# Altium schematic sheet PA_CTRL_TOP.SchDoc: 8 channel PA
size 420 x 297 mm; Author: G.K.; CompanyName: WUT; DrawnBy: G.K.; Organization: WUT ISE; Address1: Warsaw Univeristy of Technology; Address2: Nowowiejska 15/19; Revision: -; SheetNumber: -; SheetTotal: -; EDA_Number: ARTIQ; Projet: 8 Channel RF Power Amplifier; ModifiedBy: -; CreateDate: XX/XX/XXXX; CheckedDate: -; Title2: TOP; DivGrp: ISE; Designer: G.K.; ModifiedDate: -; ProjectName: 8 Channel RF Power Amplifier
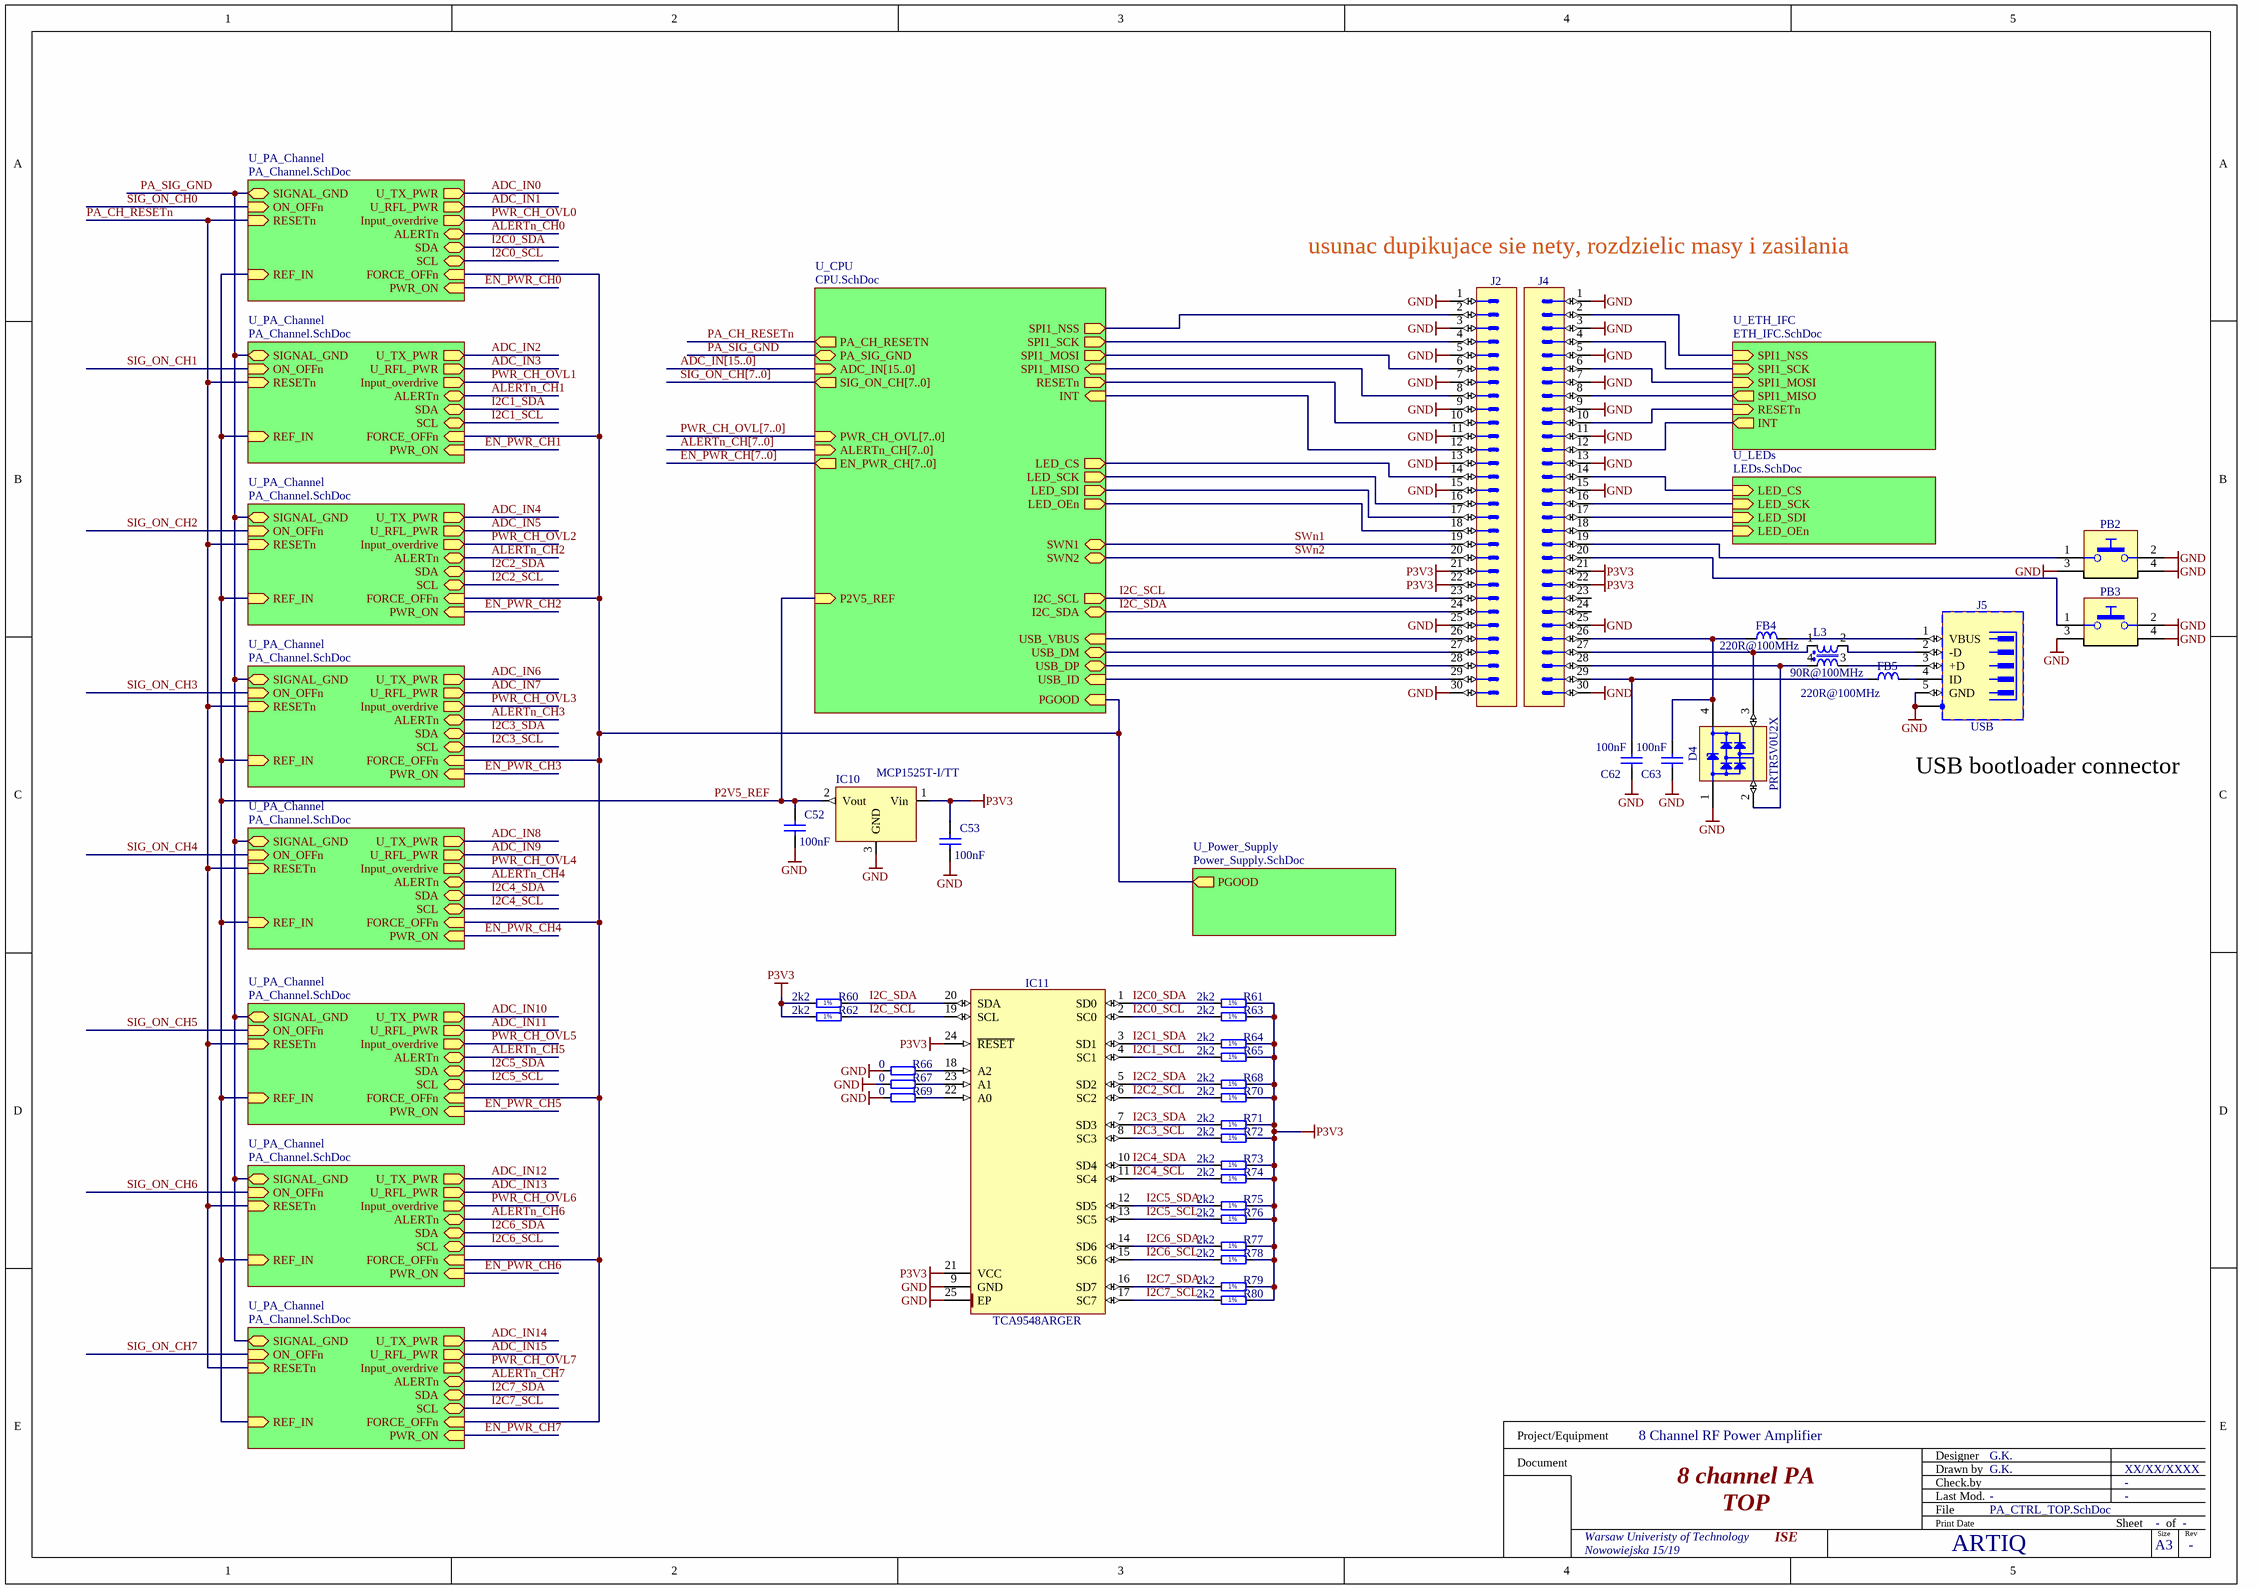
[diagram p0: PA_CTRL_TOP.SchDoc]

## Parts
C52  100nF  [CAPC1005X55N]
C53  100nF  [CAPC1005X55N]
C62  100nF  [CAPC0603X33N]
C63  100nF  [CAPC0603X33N]
D4  PRTR5V0U2X  [SOT190P230X110-4N]
FB4  220R@100MHz  [INDC2012X105N]
FB5  220R@100MHz  [INDC2012X105N]
IC10  MCP1525T-I/TT  [SOT95P251X112-3N]
IC11  TCA9548ARGER  [QFN50P400X400X100-25N-S220]
J2  (no value)  [3M_N2530-6002RB]
J4  (no value)  [3M_N2530-6002RB]
J5  USB  [WURTH_651005136521]
L3  90R@100MHz  [IND_MURATA_DLW21S]
PB2  Push Button  [PB_TYCO_1-1825027-1]  (value not drawn)
PB3  Push Button  [PB_TYCO_1-1825027-1]  (value not drawn)
R60  2k2  [RESC1005X40N]
R61  2k2  [RESC1005X40N]
R62  2k2  [RESC1005X40N]
R63  2k2  [RESC1005X40N]
R64  2k2  [RESC1005X40N]
R65  2k2  [RESC1005X40N]
R66  0  [RESC1005X40N]
R67  0  [RESC1005X40N]
R68  2k2  [RESC1005X40N]
R69  0  [RESC1005X40N]
R70  2k2  [RESC1005X40N]
R71  2k2  [RESC1005X40N]
R72  2k2  [RESC1005X40N]
R73  2k2  [RESC1005X40N]
R74  2k2  [RESC1005X40N]
R75  2k2  [RESC1005X40N]
R76  2k2  [RESC1005X40N]
R77  2k2  [RESC1005X40N]
R78  2k2  [RESC1005X40N]
R79  2k2  [RESC1005X40N]
R80  2k2  [RESC1005X40N]

## Sub-sheets
U_CPU = CPU.SchDoc: ADC_IN[15..0] (in), SIG_ON_CH[7..0] (out), PWR_CH_OVL[7..0] (in), ALERTn_CH[7..0] (in), SPI1_NSS (out), SPI1_SCK (out), SPI1_MOSI (out), SPI1_MISO (in), RESETn (out), INT (in), LED_CS (out), LED_SCK (out), LED_SDI (out), LED_OEn (out), I2C_SCL (out), I2C_SDA (bidir), P2V5_REF (in), USB_DP (bidir), USB_ID (in), USB_DM (bidir), USB_VBUS (in), PA_SIG_GND (bidir), PA_CH_RESETN (out), PGOOD (in), EN_PWR_CH[7..0] (out), SWN1 (bidir), SWN2 (bidir)
U_ETH_IFC = ETH_IFC.SchDoc: SPI1_NSS (in), SPI1_SCK (in), SPI1_MOSI (in), SPI1_MISO (out), INT (out), RESETn (in)
U_LEDs = LEDs.SchDoc: LED_CS (in), LED_SCK (in), LED_SDI (in), LED_OEn (in)
U_PA_Channel = PA_Channel.SchDoc: U_TX_PWR (out), U_RFL_PWR (out), SIGNAL_GND (bidir), SDA (bidir), SCL (bidir), ON_OFFn (in), Input_overdrive (out), ALERTn (bidir), RESETn (in), REF_IN (in), PWR_ON (in), FORCE_OFFn (in)
U_PA_Channel = PA_Channel.SchDoc: U_TX_PWR (out), U_RFL_PWR (out), SIGNAL_GND (bidir), SDA (bidir), SCL (bidir), ON_OFFn (in), Input_overdrive (out), ALERTn (bidir), RESETn (in), REF_IN (in), PWR_ON (in), FORCE_OFFn (in)
U_PA_Channel = PA_Channel.SchDoc: U_TX_PWR (out), U_RFL_PWR (out), SIGNAL_GND (bidir), SDA (bidir), SCL (bidir), ON_OFFn (in), Input_overdrive (out), ALERTn (bidir), RESETn (in), REF_IN (in), PWR_ON (in), FORCE_OFFn (in)
U_PA_Channel = PA_Channel.SchDoc: U_TX_PWR (out), U_RFL_PWR (out), SIGNAL_GND (bidir), SDA (bidir), SCL (bidir), ON_OFFn (in), Input_overdrive (out), ALERTn (bidir), RESETn (in), REF_IN (in), PWR_ON (in), FORCE_OFFn (in)
U_PA_Channel = PA_Channel.SchDoc: U_TX_PWR (out), U_RFL_PWR (out), SIGNAL_GND (bidir), SDA (bidir), SCL (bidir), ON_OFFn (in), Input_overdrive (out), ALERTn (bidir), RESETn (in), REF_IN (in), PWR_ON (in), FORCE_OFFn (in)
U_PA_Channel = PA_Channel.SchDoc: U_TX_PWR (out), U_RFL_PWR (out), SIGNAL_GND (bidir), SDA (bidir), SCL (bidir), ON_OFFn (in), Input_overdrive (out), ALERTn (bidir), RESETn (in), REF_IN (in), PWR_ON (in), FORCE_OFFn (in)
U_PA_Channel = PA_Channel.SchDoc: U_TX_PWR (out), U_RFL_PWR (out), SIGNAL_GND (bidir), SDA (bidir), SCL (bidir), ON_OFFn (in), Input_overdrive (out), ALERTn (bidir), RESETn (in), REF_IN (in), PWR_ON (in), FORCE_OFFn (in)
U_PA_Channel = PA_Channel.SchDoc: U_TX_PWR (out), U_RFL_PWR (out), SIGNAL_GND (bidir), SDA (bidir), SCL (bidir), ON_OFFn (in), Input_overdrive (out), ALERTn (bidir), RESETn (in), REF_IN (in), PWR_ON (in), FORCE_OFFn (in)
U_Power_Supply = Power_Supply.SchDoc: PGOOD (out)

## Nets
GND: C52.2 C53.2 C62.1 C63.1 D4.1(GND) IC10.3(GND) IC11.9(GND) IC11.25(EP) J2.1 J2.3 J2.5 J2.7 J2.9 J2.11 J2.13 J2.15 J2.25 J2.30 J4.1 J4.3 J4.5 J4.7 J4.9 J4.11 J4.13 J4.15 J4.25 J4.30 J5.5(GND) J5.6(SH) PB2.2 PB2.3 PB2.4 PB3.2 PB3.3 PB3.4 R66.1 R67.1 R69.1
P3V3: C53.1 IC10.1(Vin) IC11.21(VCC) IC11.24(~{RESET}) J2.21 J2.22 J4.21 J4.22 R60.1 R61.2 R62.1 R63.2 R64.2 R65.2 R68.2 R70.2 R71.2 R72.2 R73.2 R74.2 R75.2 R76.2 R77.2 R78.2 R79.2 R80.2
ADC_IN0: sheet U_PA_Channel/U_TX_PWR
ADC_IN1: sheet U_PA_Channel/U_RFL_PWR
ADC_IN2: sheet U_PA_Channel/U_TX_PWR
ADC_IN3: sheet U_PA_Channel/U_RFL_PWR
ADC_IN4: sheet U_PA_Channel/U_TX_PWR
ADC_IN5: sheet U_PA_Channel/U_RFL_PWR
ADC_IN6: sheet U_PA_Channel/U_TX_PWR
ADC_IN7: sheet U_PA_Channel/U_RFL_PWR
ADC_IN8: sheet U_PA_Channel/U_TX_PWR
ADC_IN9: sheet U_PA_Channel/U_RFL_PWR
ADC_IN10: sheet U_PA_Channel/U_TX_PWR
ADC_IN11: sheet U_PA_Channel/U_RFL_PWR
ADC_IN12: sheet U_PA_Channel/U_TX_PWR
ADC_IN13: sheet U_PA_Channel/U_RFL_PWR
ADC_IN14: sheet U_PA_Channel/U_TX_PWR
ADC_IN15: sheet U_PA_Channel/U_RFL_PWR
ALERTn_CH0: sheet U_PA_Channel/ALERTn
ALERTn_CH1: sheet U_PA_Channel/ALERTn
ALERTn_CH2: sheet U_PA_Channel/ALERTn
ALERTn_CH3: sheet U_PA_Channel/ALERTn
ALERTn_CH4: sheet U_PA_Channel/ALERTn
ALERTn_CH5: sheet U_PA_Channel/ALERTn
ALERTn_CH6: sheet U_PA_Channel/ALERTn
ALERTn_CH7: sheet U_PA_Channel/ALERTn
EN_PWR_CH0: sheet U_PA_Channel/PWR_ON
EN_PWR_CH1: sheet U_PA_Channel/PWR_ON
EN_PWR_CH2: sheet U_PA_Channel/PWR_ON
EN_PWR_CH3: sheet U_PA_Channel/PWR_ON
EN_PWR_CH4: sheet U_PA_Channel/PWR_ON
EN_PWR_CH5: sheet U_PA_Channel/PWR_ON
EN_PWR_CH6: sheet U_PA_Channel/PWR_ON
EN_PWR_CH7: sheet U_PA_Channel/PWR_ON
I2C0_SCL: IC11.2(SC0) R63.1 ; sheet U_PA_Channel/SCL
I2C0_SDA: IC11.1(SD0) R61.1 ; sheet U_PA_Channel/SDA
I2C1_SCL: IC11.4(SC1) R65.1 ; sheet U_PA_Channel/SCL
I2C1_SDA: IC11.3(SD1) R64.1 ; sheet U_PA_Channel/SDA
I2C2_SCL: IC11.6(SC2) R70.1 ; sheet U_PA_Channel/SCL
I2C2_SDA: IC11.5(SD2) R68.1 ; sheet U_PA_Channel/SDA
I2C3_SCL: IC11.8(SC3) R72.1 ; sheet U_PA_Channel/SCL
I2C3_SDA: IC11.7(SD3) R71.1 ; sheet U_PA_Channel/SDA
I2C4_SCL: IC11.11(SC4) R74.1 ; sheet U_PA_Channel/SCL
I2C4_SDA: IC11.10(SD4) R73.1 ; sheet U_PA_Channel/SDA
I2C5_SCL: IC11.13(SC5) R76.1 ; sheet U_PA_Channel/SCL
I2C5_SDA: IC11.12(SD5) R75.1 ; sheet U_PA_Channel/SDA
I2C6_SCL: IC11.15(SC6) R78.1 ; sheet U_PA_Channel/SCL
I2C6_SDA: IC11.14(SD6) R77.1 ; sheet U_PA_Channel/SDA
I2C7_SCL: IC11.17(SC7) R80.1 ; sheet U_PA_Channel/SCL
I2C7_SDA: IC11.16(SD7) R79.1 ; sheet U_PA_Channel/SDA
I2C_SCL: IC11.19(SCL) J2.23 R62.2 ; sheet U_CPU/I2C_SCL
I2C_SDA: IC11.20(SDA) J2.24 R60.2 ; sheet U_CPU/I2C_SDA
P2V5_REF: C52.1 IC10.2(Vout) ; sheet U_CPU/P2V5_REF, sheet U_PA_Channel/REF_IN, sheet U_PA_Channel/REF_IN, sheet U_PA_Channel/REF_IN, sheet U_PA_Channel/REF_IN, sheet U_PA_Channel/REF_IN, sheet U_PA_Channel/REF_IN, sheet U_PA_Channel/REF_IN, sheet U_PA_Channel/REF_IN
PA_CH_RESETn: sheet U_CPU/PA_CH_RESETN, sheet U_PA_Channel/RESETn, sheet U_PA_Channel/RESETn, sheet U_PA_Channel/RESETn, sheet U_PA_Channel/RESETn, sheet U_PA_Channel/RESETn, sheet U_PA_Channel/RESETn, sheet U_PA_Channel/RESETn, sheet U_PA_Channel/RESETn
PA_SIG_GND: sheet U_CPU/PA_SIG_GND, sheet U_PA_Channel/SIGNAL_GND, sheet U_PA_Channel/SIGNAL_GND, sheet U_PA_Channel/SIGNAL_GND, sheet U_PA_Channel/SIGNAL_GND, sheet U_PA_Channel/SIGNAL_GND, sheet U_PA_Channel/SIGNAL_GND, sheet U_PA_Channel/SIGNAL_GND, sheet U_PA_Channel/SIGNAL_GND
PWR_CH_OVL0: sheet U_PA_Channel/Input_overdrive
PWR_CH_OVL1: sheet U_PA_Channel/Input_overdrive
PWR_CH_OVL2: sheet U_PA_Channel/Input_overdrive
PWR_CH_OVL3: sheet U_PA_Channel/Input_overdrive
PWR_CH_OVL4: sheet U_PA_Channel/Input_overdrive
PWR_CH_OVL5: sheet U_PA_Channel/Input_overdrive
PWR_CH_OVL6: sheet U_PA_Channel/Input_overdrive
PWR_CH_OVL7: sheet U_PA_Channel/Input_overdrive
SIG_ON_CH0: sheet U_PA_Channel/ON_OFFn
SIG_ON_CH1: sheet U_PA_Channel/ON_OFFn
SIG_ON_CH2: sheet U_PA_Channel/ON_OFFn
SIG_ON_CH3: sheet U_PA_Channel/ON_OFFn
SIG_ON_CH4: sheet U_PA_Channel/ON_OFFn
SIG_ON_CH5: sheet U_PA_Channel/ON_OFFn
SIG_ON_CH6: sheet U_PA_Channel/ON_OFFn
SIG_ON_CH7: sheet U_PA_Channel/ON_OFFn
SWn1: J2.19 ; sheet U_CPU/SWN1
SWn2: J2.20 ; sheet U_CPU/SWN2
NetC62_2: C62.2 FB5.1 J4.29
NetC63_2: C63.2 D4.4(VCC) FB4.1 J4.26
NetD4_2: D4.2(I/O1) J4.28 L3.4
NetD4_3: D4.3(I/O2) J4.27 L3.1
NetFB4_2: FB4.2 J5.1(VBUS)
NetFB5_2: FB5.2 J5.4(ID)
NetIC11_18: IC11.18(A2) R66.2
NetIC11_22: IC11.22(A0) R69.2
NetIC11_23: IC11.23(A1) R67.2
NetJ2_2: J2.2 ; sheet U_CPU/SPI1_NSS
NetJ2_4: J2.4 ; sheet U_CPU/SPI1_SCK
NetJ2_6: J2.6 ; sheet U_CPU/SPI1_MOSI
NetJ2_8: J2.8 ; sheet U_CPU/SPI1_MISO
NetJ2_10: J2.10 ; sheet U_CPU/RESETn
NetJ2_12: J2.12 ; sheet U_CPU/INT
NetJ2_14: J2.14 ; sheet U_CPU/LED_CS
NetJ2_16: J2.16 ; sheet U_CPU/LED_SCK
NetJ2_17: J2.17 ; sheet U_CPU/LED_SDI
NetJ2_18: J2.18 ; sheet U_CPU/LED_OEn
NetJ2_26: J2.26 ; sheet U_CPU/USB_VBUS
NetJ2_27: J2.27 ; sheet U_CPU/USB_DM
NetJ2_28: J2.28 ; sheet U_CPU/USB_DP
NetJ2_29: J2.29 ; sheet U_CPU/USB_ID
NetJ4_2: J4.2 ; sheet U_ETH_IFC/SPI1_NSS
NetJ4_4: J4.4 ; sheet U_ETH_IFC/SPI1_SCK
NetJ4_6: J4.6 ; sheet U_ETH_IFC/SPI1_MOSI
NetJ4_8: J4.8 ; sheet U_ETH_IFC/SPI1_MISO
NetJ4_10: J4.10 ; sheet U_ETH_IFC/RESETn
NetJ4_12: J4.12 ; sheet U_ETH_IFC/INT
NetJ4_14: J4.14 ; sheet U_LEDs/LED_CS
NetJ4_16: J4.16 ; sheet U_LEDs/LED_SCK
NetJ4_17: J4.17 ; sheet U_LEDs/LED_SDI
NetJ4_18: J4.18 ; sheet U_LEDs/LED_OEn
NetJ4_19: J4.19 PB2.1
NetJ4_20: J4.20 PB3.1
NetJ5_2: J5.2(-D) L3.2
NetJ5_3: J5.3(+D) L3.3
(unnamed): sheet U_CPU/PGOOD, sheet U_PA_Channel/FORCE_OFFn, sheet U_PA_Channel/FORCE_OFFn, sheet U_PA_Channel/FORCE_OFFn, sheet U_PA_Channel/FORCE_OFFn, sheet U_PA_Channel/FORCE_OFFn, sheet U_PA_Channel/FORCE_OFFn, sheet U_PA_Channel/FORCE_OFFn, sheet U_PA_Channel/FORCE_OFFn, sheet U_Power_Supply/PGOOD

Not connected (* = marked no-connect by the designer): J4 23 24

## Buses and harness runs
bus ADC_IN[15..0] = sheet U_CPU/ADC_IN[15..0]
bus ALERTn_CH[7..0] = sheet U_CPU/ALERTn_CH[7..0]
bus EN_PWR_CH[7..0] = sheet U_CPU/EN_PWR_CH[7..0]
bus PWR_CH_OVL[7..0] = sheet U_CPU/PWR_CH_OVL[7..0]
bus SIG_ON_CH[7..0] = sheet U_CPU/SIG_ON_CH[7..0]

## Notes on the sheet
- usunac dupikujace sie nety, rozdzielic masy i zasilania
- (near J5) USB bootloader connector
- Project/Equipment
- Document
- Designer
- Drawn by
- Check.by
- File
- Last Mod.
- Print Date
- Sheet
- Size
- A3
- of
- Rev
- (in symbol R0402_2K2_1%_0.0625W_100PPM) 1%

## Library data of the parts
C52 C53 = CC0402_100NF_16V_10%_X7R: Non-polarised capacitor; Part Description: SMD Multilayer Chip Ceramic Capacitor; Manufacturer: GENERIC; Manufacturer1 Part Number: GRM155R71C104KA88D; Voltage: 16V; TC: X7R; Tolerance: ±10%; Table: Capacitors SMD; Part Number: CC0402_100NF_16V_10%_X7R; Component Kind: Standard; Component Type: Standard; Pin Count: 2; Value: 100nF; Status: Not Recommended; Manufacturer Part Number: CC0402_100NF_16V_10%_X7R; Case: 0402; Mounted: Yes; Socket: No; SMD: Yes; Manufacturer1 Example: MURATA; Manufacturer1 ComponentHeight: 0.55mm; HelpURL: \\cern.ch\dfs\Applications\Altium\Datasheets\CC0402_X7R_MURATA_GRM.pdf; Author: CERN DEM JLC; CreateDate: 2013-12-05; LatestRevisionDate: 2007-12-03
C62 C63 = CC0201_100NF_6.3V_10%_X5R: Non-polarised capacitor; Part Description: SMD Multilayer Chip Ceramic Capacitor; Manufacturer: GENERIC; Manufacturer1 Part Number: 02016D104KAT2A; Voltage: 6.3V; TC: X5R; Tolerance: ±10%; Table: Capacitors SMD; Part Number: CC0201_100NF_6.3V_10%_X5R; Component Kind: Standard; Component Type: Standard; Pin Count: 2; Value: 100nF; Status: Not Recommended; Manufacturer Part Number: CC0201_100NF_6.3V_10%_X5R; Case: 0201; Mounted: Yes; Socket: No; SMD: Yes; Manufacturer1 Example: AVX; Manufacturer1 ComponentHeight: 0.33mm; HelpURL: \\cern.ch\dfs\Applications\Altium\Datasheets\CC0201_X5R_AVX.pdf; Author: CERN DEM JLC; CreateDate: 2007-12-03; LatestRevisionDate: 2007-12-03
D4 = PRTR5V0U2X: Ultra Low Capacitance Double Rail-to-Rail ESD Protection Diode; Part Description: Ultra Low Capacitance (1pF) Double Rail-to-Rail ESD Protection Diode (8kV); Manufacturer: NXP SEMICONDUCTORS; Voltage: 5.5V; PressFit: No; Bonding: No; Part Number: PRTR5V0U2X; Component Kind: Standard; Component Type: Standard; Device: PRTR5V0U2X; PackageDescription: SOT143B, SOT, 1.90mm Pitch; 4 Pin, 1.30mm W X 2.90mm L X 1.10mm H body, IPC Medium Density; Manufacturer Part Number: PRTR5V0U2X; Pin Count: 4; Case: SOT143B; Mounted: Yes; Socket: No; SMD: Yes; Sense: No; ComponentHeight: 1.1mm; HelpURL: \\cern.ch\dfs\Applications\Altium\Datasheets\PRTR5V0U2X.pdf; Author: CERN DEM JLC; CreateDate: 22.03.2011; LatestRevisionDate: 22.03.2011
FB4 FB5 = IND0805_MURATA_BLM21PG221SN1D: Inductor; Part Description: SMD EMIFIL Suppression Chip Ferrite Bead; Manufacturer: MURATA; Power: 2A; Resistance: 0.05R; Tolerance: ±25%; Table: Inductors SMD; Part Number: IND0805_MURATA_BLM21PG221SN1D; Component Kind: Standard; Component Type: Standard; Pin Count: 2; Value: 220R@100MHz; Status: None; Manufacturer Part Number: BLM21PG221SN1D; Case: 0805; Mounted: Yes; Socket: No; SMD: Yes; ComponentHeight: 1.05mm; HelpURL: \\cern.ch\dfs\Applications\Altium\Datasheets\IND0402_MURATA_BLM21P.pdf; Author: CERN DEM JLC; CreateDate: 2010-01-25; LatestRevisionDate: 2010-01-25
IC10 = REF_MCP1525: 2.5 voltage reference
IC11 = TCA9548ARGER: Low Voltage 8-Channel I2C Switch With Reset; Manufacturer: TEXAS INSTRUMENTS; PressFit: No; Bonding: No; Part Number: TCA9548ARGER; Component Kind: Standard; Component Type: Standard; Device: TCA9548ARGER; PackageDescription: QFN, 0.50mm Pitch, Square; 24 Pin, 4.00mm L X 4.00mm W X 1.00mm H body (w/thermal tab 2.2 X 2.2mm), IPC Medium Density; Part Description: Low Voltage 8-Channel I2C Switch With Reset; Manufacturer Part Number: TCA9548ARGER; Pin Count: 25; Case: QFN24; Mounted: Yes; Socket: No; SMD: Yes; Sense: No; ComponentHeight: 1mm; Author: CERN DEM JLC; HelpURL: \\cern.ch\dfs\Applications\Altium\Datasheets\TCA9548ARGER.pdf; CreateDate: 07.07.2014; LatestRevisionDate: 07.07.2014
J2 J4 = 3M_N2530-6002RB: Connector 30 Male; Part Description: 30 Contacts - Straight .100'' x .100'' Low Profile Four-Wall Header, 2500 Series; Manufacturer: 3M; PressFit: No; Part Number: 3M_N2530-6002RB; Component Kind: Standard; Component Type: Standard; Pin Count: 30; Family: Header 30; Mounted: Yes; Socket: No; SMD: No; Sense: No; Status: None; Manufacturer Part Number: N2530-6002RB; ComponentHeight: 10.03mm; HelpURL: \\cern.ch\dfs\Applications\Altium\Datasheets\3M_N2530-6002RB.pdf; Author: CERN DEM JLC; CreateDate: 11.02.2009; LatestRevisionDate: 11.08.2009
J5 = WURTH_651005136521: 5 Pin + 1 Shield USB Receptacle; Part Description: Mini USB Type B  Receptacle, Horizontal, 5 Contacts; Manufacturer: WURTH ELEKTRONIK; PressFit: No; Part Number: WURTH_651005136521; Component Kind: Standard; Component Type: Standard; Pin Count: 6; Family: USB; Mounted: Yes; Socket: No; SMD: No; Sense: No; Status: None; Manufacturer Part Number: 651005136521; ComponentHeight: 3.9mm; HelpURL: \\cern.ch\dfs\Applications\Altium\Datasheets\WURTH_651005136521.pdf; Author: CERN DEM JLC; CreateDate: 07.03.2011; LatestRevisionDate: 07.03.2011
L3 = IND_MURATA_DLW21SN900SQ2L: Inductor Common Mode; Part Description: Wire Wound Common Mode Choke Coil (DLW21S Series); Manufacturer: MURATA; Power: 330mA; Resistance: 0.35R; Tolerance: ±25%; Part Number: IND_MURATA_DLW21SN900SQ2L; Component Kind: Standard; Component Type: Standard; Pin Count: 4; Value: 90R@100MHz; Status: None; Manufacturer Part Number: DLW21SN900SQ2L; Case: 0805; Mounted: Yes; Socket: No; SMD: Yes; Sense: No; ComponentHeight: 1.4mm; HelpURL: \\cern.ch\dfs\Applications\Altium\Datasheets\IND_MURATA_DLW21S.pdf; Author: CERN DEM JLC; CreateDate: 01.07.2014; LatestRevisionDate: 01.07.2014
PB2 PB3 = PB_TYCO_1-1825027-1: Push-Button Switch SPDT; Part Description: Right Angle Micro Miniature Tactile Pushbutton Switch, Round Actuator Length = 5.74mm, FSMRAJ Serie; Manufacturer: TYCO ELECTRONICS; PressFit: No; Part Number: PB_TYCO_1-1825027-1; Component Kind: Standard; Component Type: Standard; Pin Count: 4; PackageDescription: Right Angle Micro Miniature Tactile Pushbutton Switch, Round Actuator Length = 5.74mm, FSMRAJ Serie; Family: Push Button; Mounted: Yes; Socket: No; SMD: No; Sense: No; Status: None; Manufacturer Part Number: 1-1825027-1; ComponentHeight: 7.01mm; HelpURL: \\cern.ch\dfs\Applications\Altium\Datasheets\PB_TYCO_1-1825027-1.pdf; Author: CERN DEM JLC; CreateDate: 17.04.2013; LatestRevisionDate: 28.10.2013
R60-R65 R68 R70-R80 = R0402_2K2_1%_0.0625W_100PPM: Resistor - 1%; Part Description: General Purpose Thick Film Chip Resistor; Manufacturer: GENERIC; Manufacturer1 Part Number: 232270672202L; TC: ±100ppm/°C; Part Number: R0402_2K2_1%_0.0625W_100PPM; Component Kind: Standard; Component Type: Standard; Pin Count: 2; Value: 2k2; Status: Not recommended; Power: 0.0625W; Tolerance: ±1%; Manufacturer Part Number: R0402_2K2_1%_0.0625W_100PPM; Case: 0402; Mounted: Yes; Sense: No; Socket: No; SMD: Yes; Manufacturer1 Example: YAGEO PHYCOMP; Manufacturer1 ComponentHeight: 0.4mm; HelpURL: \\cern.ch\dfs\Applications\Altium\Datasheets\R0402_Phycomp_RC0402.pdf; Author: CERN DEM JLC; CreateDate: 03.12.2007; LatestRevisionDate: 17.10.2012
R66 R67 R69 = R0402_0R_JUMPER: Resistor; Part Description: 1A (0.05R Max DC Resistance) Zero Ohm Jumper; Manufacturer: GENERIC; Manufacturer1 Part Number: 232270591001L; Part Number: R0402_0R_JUMPER; Component Kind: Standard; Component Type: Standard; Pin Count: 2; Value: 0; Status: Not recommended; Manufacturer Part Number: R0402_0R_JUMPER; Case: 0402; Mounted: Yes; Sense: No; Socket: No; SMD: Yes; Manufacturer1 Example: YAGEO PHYCOMP; Manufacturer1 ComponentHeight: 0.4mm; HelpURL: \\cern.ch\dfs\Applications\Altium\Datasheets\R0402_Phycomp_RC0402.pdf; Author: CERN DEM JLC; CreateDate: 03.12.2007; LatestRevisionDate: 17.10.2012